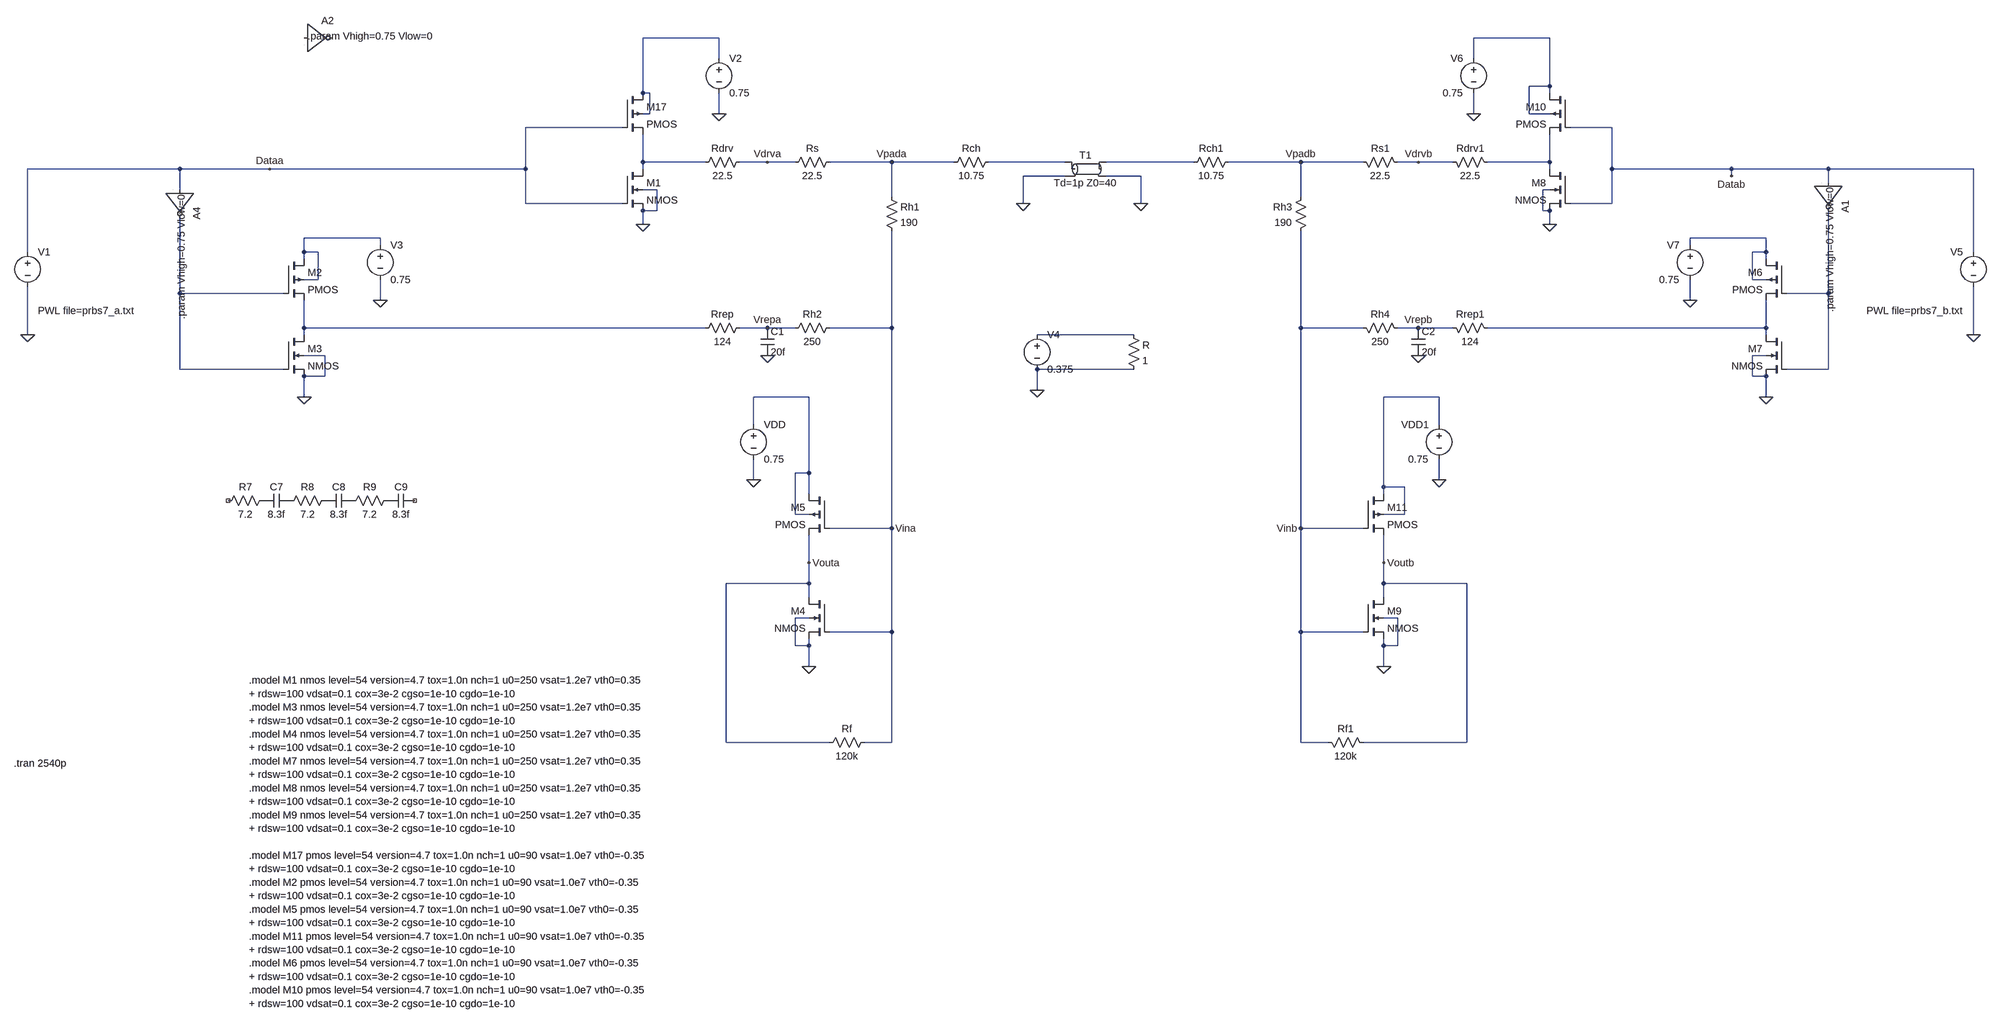
[diagram p0: schematic nvidia.asc]
nvidia.asc, the LTspice schematic file:
Version 4
SHEET 1 3748 1968
WIRE 144 -208 -32 -208
WIRE 2288 -208 2112 -208
WIRE 144 -160 144 -208
WIRE 2112 -160 2112 -208
WIRE 2288 -96 2288 -208
WIRE 2288 -96 2240 -96
WIRE -32 -80 -32 -208
WIRE -16 -80 -32 -80
WIRE 2288 -80 2288 -96
WIRE -16 -32 -16 -80
WIRE -16 -32 -32 -32
WIRE 144 -32 144 -80
WIRE 2112 -32 2112 -80
WIRE 2240 -32 2240 -96
WIRE 2288 -32 2240 -32
WIRE -80 0 -304 0
WIRE 2432 0 2336 0
WIRE -32 80 -32 16
WIRE 112 80 -32 80
WIRE 256 80 192 80
WIRE 320 80 256 80
WIRE 544 80 400 80
WIRE 688 80 544 80
WIRE 944 80 768 80
WIRE 1328 80 1040 80
WIRE 1712 80 1408 80
WIRE 1856 80 1712 80
WIRE 1984 80 1936 80
WIRE 2064 80 1984 80
WIRE 2288 80 2288 16
WIRE 2288 80 2144 80
WIRE -1104 96 -1456 96
WIRE -896 96 -1104 96
WIRE -304 96 -304 0
WIRE -304 96 -896 96
WIRE -32 96 -32 80
WIRE 2288 96 2288 80
WIRE 2432 96 2432 0
WIRE 3152 96 2432 96
WIRE 3376 96 3152 96
WIRE 3712 96 3376 96
WIRE 944 112 848 112
WIRE 1120 112 1040 112
WIRE 3152 112 3152 96
WIRE 3376 128 3376 96
WIRE -1104 144 -1104 96
WIRE 0 144 -32 144
WIRE 2288 144 2272 144
WIRE 544 160 544 80
WIRE 1712 160 1712 80
WIRE -304 176 -304 96
WIRE -80 176 -304 176
WIRE 848 176 848 112
WIRE 1120 176 1120 112
WIRE 2432 176 2432 96
WIRE 2432 176 2336 176
WIRE 0 192 0 144
WIRE 0 192 -32 192
WIRE 2272 192 2272 144
WIRE 2288 192 2272 192
WIRE -32 224 -32 192
WIRE 2288 224 2288 192
WIRE -640 256 -816 256
WIRE 3232 256 3056 256
WIRE -640 272 -640 256
WIRE 3056 272 3056 256
WIRE -1456 288 -1456 96
WIRE -816 288 -816 256
WIRE -784 288 -816 288
WIRE 3232 288 3232 256
WIRE 3232 288 3200 288
WIRE 3712 288 3712 96
WIRE -816 304 -816 288
WIRE 3232 304 3232 288
WIRE -784 352 -784 288
WIRE -784 352 -816 352
WIRE 3200 352 3200 288
WIRE 3232 352 3200 352
WIRE -1104 384 -1104 208
WIRE -864 384 -1104 384
WIRE 3376 384 3376 192
WIRE 3376 384 3280 384
WIRE -640 400 -640 352
WIRE 3056 400 3056 352
WIRE -816 464 -816 400
WIRE 112 464 -816 464
WIRE 256 464 192 464
WIRE 320 464 256 464
WIRE 544 464 544 240
WIRE 544 464 400 464
WIRE 1712 464 1712 240
WIRE 1856 464 1712 464
WIRE 1984 464 1936 464
WIRE 2064 464 1984 464
WIRE 3232 464 3232 400
WIRE 3232 464 2144 464
WIRE -1456 480 -1456 368
WIRE -816 480 -816 464
WIRE 1104 480 880 480
WIRE 3232 480 3232 464
WIRE 3712 480 3712 368
WIRE -768 528 -816 528
WIRE 3232 528 3200 528
WIRE -1104 560 -1104 384
WIRE -864 560 -1104 560
WIRE 1104 560 880 560
WIRE 3376 560 3376 384
WIRE 3376 560 3280 560
WIRE -768 576 -768 528
WIRE -768 576 -816 576
WIRE 3200 576 3200 528
WIRE 3232 576 3200 576
WIRE 880 608 880 560
WIRE -816 624 -816 576
WIRE 352 624 224 624
WIRE 2032 624 1904 624
WIRE 3232 624 3232 576
WIRE 224 688 224 624
WIRE 2032 688 2032 624
WIRE 352 800 352 624
WIRE 352 800 320 800
WIRE 224 816 224 768
WIRE 2032 816 2032 768
WIRE 1904 832 1904 624
WIRE 1952 832 1904 832
WIRE 352 848 352 800
WIRE 1904 848 1904 832
WIRE 320 896 320 800
WIRE 352 896 320 896
WIRE 1952 896 1952 832
WIRE 1952 896 1904 896
WIRE 544 928 544 464
WIRE 544 928 400 928
WIRE 1712 928 1712 464
WIRE 1856 928 1712 928
WIRE 352 1008 352 944
WIRE 1904 1008 1904 944
WIRE 352 1056 352 1008
WIRE 352 1056 160 1056
WIRE 1904 1056 1904 1008
WIRE 2096 1056 1904 1056
WIRE 352 1088 352 1056
WIRE 1904 1088 1904 1056
WIRE 352 1136 320 1136
WIRE 1936 1136 1904 1136
WIRE 544 1168 544 928
WIRE 544 1168 400 1168
WIRE 1712 1168 1712 928
WIRE 1856 1168 1712 1168
WIRE 320 1200 320 1136
WIRE 352 1200 352 1184
WIRE 352 1200 320 1200
WIRE 1904 1200 1904 1184
WIRE 1936 1200 1936 1136
WIRE 1936 1200 1904 1200
WIRE 352 1248 352 1200
WIRE 1904 1248 1904 1200
WIRE 160 1424 160 1056
WIRE 400 1424 160 1424
WIRE 544 1424 544 1168
WIRE 544 1424 480 1424
WIRE 1712 1424 1712 1168
WIRE 1776 1424 1712 1424
WIRE 2096 1424 2096 1056
WIRE 2096 1424 1856 1424
FLAG 848 176 0
FLAG 1120 176 0
FLAG 224 816 0
FLAG 352 1248 0
FLAG 352 1008 Vouta
FLAG 544 928 Vina
FLAG 144 -32 0
FLAG -640 400 0
FLAG -32 224 0
FLAG -816 624 0
FLAG -1456 480 0
FLAG 2032 816 0
FLAG 1904 1248 0
FLAG 1904 1008 Voutb
FLAG 1712 928 Vinb
FLAG 2112 -32 0
FLAG 3056 400 0
FLAG 2288 224 0
FLAG 3232 624 0
FLAG 3712 480 0
FLAG 544 80 Vpada
FLAG 256 80 Vdrva
FLAG 256 464 Vrepa
FLAG -896 96 Dataa
FLAG 1984 80 Vdrvb
FLAG 1984 464 Vrepb
FLAG 3152 112 Datab
FLAG 1712 80 Vpadb
FLAG 256 528 0
FLAG 1984 528 0
FLAG 880 608 0
SYMBOL voltage -1456 272 R0
WINDOW 3 24 152 Left 2
WINDOW 123 0 0 Left 0
WINDOW 39 24 124 Left 2
SYMATTR Value PWL file=prbs7_a.txt
SYMATTR InstName V1
SYMBOL res 416 64 R90
WINDOW 0 0 56 VBottom 2
WINDOW 3 32 56 VTop 2
SYMATTR InstName Rs
SYMATTR Value 22.5
SYMBOL res 528 144 R0
SYMATTR InstName Rh1
SYMATTR Value 190
SYMBOL res 416 448 R90
WINDOW 0 0 56 VBottom 2
WINDOW 3 32 56 VTop 2
SYMATTR InstName Rh2
SYMATTR Value 250
SYMBOL res 784 64 R90
WINDOW 0 0 56 VBottom 2
WINDOW 3 32 56 VTop 2
SYMATTR InstName Rch
SYMATTR Value 10.75
SYMBOL tline 992 96 R0
SYMATTR InstName T1
SYMATTR Value Td=1p Z0=40
SYMBOL voltage 224 672 R0
WINDOW 123 0 0 Left 0
WINDOW 39 0 0 Left 0
SYMATTR InstName VDD
SYMATTR Value 0.75
SYMBOL res 496 1408 R90
WINDOW 0 0 56 VBottom 2
WINDOW 3 32 56 VTop 2
SYMATTR InstName Rf
SYMATTR Value 120k
SYMBOL voltage 144 -176 R0
WINDOW 123 0 0 Left 0
WINDOW 39 0 0 Left 0
SYMATTR InstName V2
SYMATTR Value 0.75
SYMBOL voltage -640 256 R0
WINDOW 123 0 0 Left 0
WINDOW 39 0 0 Left 0
SYMATTR InstName V3
SYMATTR Value 0.75
SYMBOL res 208 64 R90
WINDOW 0 0 56 VBottom 2
WINDOW 3 32 56 VTop 2
SYMATTR InstName Rdrv
SYMATTR Value 22.5
SYMBOL res 208 448 R90
WINDOW 0 0 56 VBottom 2
WINDOW 3 32 56 VTop 2
SYMATTR InstName Rrep
SYMATTR Value 124
SYMBOL voltage 3712 272 M0
WINDOW 3 24 152 Left 2
WINDOW 123 0 0 Left 0
WINDOW 39 24 124 Left 2
SYMATTR Value PWL file=prbs7_b.txt
SYMATTR InstName V5
SYMBOL res 1840 64 M90
WINDOW 0 0 56 VBottom 2
WINDOW 3 32 56 VTop 2
SYMATTR InstName Rs1
SYMATTR Value 22.5
SYMBOL res 1728 144 M0
SYMATTR InstName Rh3
SYMATTR Value 190
SYMBOL res 1840 448 M90
WINDOW 0 0 56 VBottom 2
WINDOW 3 32 56 VTop 2
SYMATTR InstName Rh4
SYMATTR Value 250
SYMBOL voltage 2032 672 M0
WINDOW 123 0 0 Left 0
WINDOW 39 0 0 Left 0
SYMATTR InstName VDD1
SYMATTR Value 0.75
SYMBOL res 1760 1408 M90
WINDOW 0 0 56 VBottom 2
WINDOW 3 32 56 VTop 2
SYMATTR InstName Rf1
SYMATTR Value 120k
SYMBOL voltage 2112 -176 M0
WINDOW 123 0 0 Left 0
WINDOW 39 0 0 Left 0
SYMATTR InstName V6
SYMATTR Value 0.75
SYMBOL voltage 3056 256 M0
WINDOW 123 0 0 Left 0
WINDOW 39 0 0 Left 0
SYMATTR InstName V7
SYMATTR Value 0.75
SYMBOL res 2048 64 M90
WINDOW 0 0 56 VBottom 2
WINDOW 3 32 56 VTop 2
SYMATTR InstName Rdrv1
SYMATTR Value 22.5
SYMBOL res 2048 448 M90
WINDOW 0 0 56 VBottom 2
WINDOW 3 32 56 VTop 2
SYMATTR InstName Rrep1
SYMATTR Value 124
SYMBOL Digital\\inv -816 -272 R0
WINDOW 3 8 60 Left 2
SYMATTR Value .param Vhigh=0.75 Vlow=0
SYMATTR InstName A2
SYMBOL pmos4 -80 -80 R0
SYMATTR InstName M17
SYMATTR Value2 l=45n w=1.0u
SYMBOL nmos4 -80 96 R0
SYMATTR InstName M1
SYMATTR Value2 l=45n w=1.0u
SYMBOL res 1424 64 R90
WINDOW 0 0 56 VBottom 2
WINDOW 3 32 56 VTop 2
SYMATTR InstName Rch1
SYMATTR Value 10.75
SYMBOL pmos4 -864 304 R0
SYMATTR InstName M2
SYMATTR Value2 l=45n w=1.0u
SYMBOL pmos4 400 848 M0
SYMATTR InstName M5
SYMATTR Value2 l=45n w=1.0u
SYMBOL pmos4 3280 304 M0
SYMATTR InstName M6
SYMATTR Value2 l=45n w=1.0u
SYMBOL pmos4 2336 -80 M0
SYMATTR InstName M10
SYMATTR Value2 l=45n w=1.0u
SYMBOL pmos4 1856 848 R0
SYMATTR InstName M11
SYMATTR Value2 l=45n w=1.0u
SYMBOL nmos4 -864 480 R0
SYMATTR InstName M3
SYMATTR Value2 l=45n w=1.0u
SYMBOL nmos4 400 1088 M0
SYMATTR InstName M4
SYMATTR Value2 l=45n w=1.0u
SYMBOL nmos4 3280 480 M0
SYMATTR InstName M7
SYMATTR Value2 l=45n w=1.0u
SYMBOL nmos4 2336 96 M0
SYMATTR InstName M8
SYMATTR Value2 l=45n w=1.0u
SYMBOL nmos4 1856 1088 R0
SYMATTR InstName M9
SYMATTR Value2 l=45n w=1.0u
SYMBOL Digital\\inv -1040 144 R90
WINDOW 3 8 60 Left 2
SYMATTR Value .param Vhigh=0.75 Vlow=0
SYMATTR InstName A4
SYMBOL Digital\\inv 3440 128 R90
WINDOW 3 8 60 Left 2
SYMATTR Value .param Vhigh=0.75 Vlow=0
SYMATTR InstName A1
SYMBOL res -896 848 R90
WINDOW 0 0 56 VBottom 2
WINDOW 3 32 56 VTop 2
SYMATTR InstName R7
SYMATTR Value 7.2
SYMBOL cap -848 848 R90
WINDOW 0 0 32 VBottom 2
WINDOW 3 32 32 VTop 2
SYMATTR InstName C7
SYMATTR Value 8.3f
SYMBOL res -752 848 R90
WINDOW 0 0 56 VBottom 2
WINDOW 3 32 56 VTop 2
SYMATTR InstName R8
SYMATTR Value 7.2
SYMBOL cap -704 848 R90
WINDOW 0 0 32 VBottom 2
WINDOW 3 32 32 VTop 2
SYMATTR InstName C8
SYMATTR Value 8.3f
SYMBOL res -608 848 R90
WINDOW 0 0 56 VBottom 2
WINDOW 3 32 56 VTop 2
SYMATTR InstName R9
SYMATTR Value 7.2
SYMBOL cap -560 848 R90
WINDOW 0 0 32 VBottom 2
WINDOW 3 32 32 VTop 2
SYMATTR InstName C9
SYMATTR Value 8.3f
SYMBOL cap 240 464 R0
SYMATTR InstName C1
SYMATTR Value 20f
SYMBOL cap 1968 464 R0
SYMATTR InstName C2
SYMATTR Value 20f
SYMBOL voltage 880 464 R0
WINDOW 123 0 0 Left 0
WINDOW 39 0 0 Left 0
SYMATTR InstName V4
SYMATTR Value 0.375
SYMBOL res 1088 464 R0
SYMATTR InstName R
SYMATTR Value 1
TEXT -1488 1472 Left 2 !.tran 2540p
TEXT -944 1280 Left 2 !.model M1 nmos level=54 version=4.7 tox=1.0n nch=1 u0=250 vsat=1.2e7 vth0=0.35\n+ rdsw=100 vdsat=0.1 cox=3e-2 cgso=1e-10 cgdo=1e-10\n.model M3 nmos level=54 version=4.7 tox=1.0n nch=1 u0=250 vsat=1.2e7 vth0=0.35\n+ rdsw=100 vdsat=0.1 cox=3e-2 cgso=1e-10 cgdo=1e-10\n.model M4 nmos level=54 version=4.7 tox=1.0n nch=1 u0=250 vsat=1.2e7 vth0=0.35\n+ rdsw=100 vdsat=0.1 cox=3e-2 cgso=1e-10 cgdo=1e-10\n.model M7 nmos level=54 version=4.7 tox=1.0n nch=1 u0=250 vsat=1.2e7 vth0=0.35\n+ rdsw=100 vdsat=0.1 cox=3e-2 cgso=1e-10 cgdo=1e-10\n.model M8 nmos level=54 version=4.7 tox=1.0n nch=1 u0=250 vsat=1.2e7 vth0=0.35\n+ rdsw=100 vdsat=0.1 cox=3e-2 cgso=1e-10 cgdo=1e-10\n.model M9 nmos level=54 version=4.7 tox=1.0n nch=1 u0=250 vsat=1.2e7 vth0=0.35\n+ rdsw=100 vdsat=0.1 cox=3e-2 cgso=1e-10 cgdo=1e-10\n \n.model M17 pmos level=54 version=4.7 tox=1.0n nch=1 u0=90 vsat=1.0e7 vth0=-0.35\n+ rdsw=100 vdsat=0.1 cox=3e-2 cgso=1e-10 cgdo=1e-10\n.model M2 pmos level=54 version=4.7 tox=1.0n nch=1 u0=90 vsat=1.0e7 vth0=-0.35\n+ rdsw=100 vdsat=0.1 cox=3e-2 cgso=1e-10 cgdo=1e-10\n.model M5 pmos level=54 version=4.7 tox=1.0n nch=1 u0=90 vsat=1.0e7 vth0=-0.35\n+ rdsw=100 vdsat=0.1 cox=3e-2 cgso=1e-10 cgdo=1e-10\n.model M11 pmos level=54 version=4.7 tox=1.0n nch=1 u0=90 vsat=1.0e7 vth0=-0.35\n+ rdsw=100 vdsat=0.1 cox=3e-2 cgso=1e-10 cgdo=1e-10\n.model M6 pmos level=54 version=4.7 tox=1.0n nch=1 u0=90 vsat=1.0e7 vth0=-0.35\n+ rdsw=100 vdsat=0.1 cox=3e-2 cgso=1e-10 cgdo=1e-10\n.model M10 pmos level=54 version=4.7 tox=1.0n nch=1 u0=90 vsat=1.0e7 vth0=-0.35\n+ rdsw=100 vdsat=0.1 cox=3e-2 cgso=1e-10 cgdo=1e-10

The netlist it stands for:
* nvidia.asc
V1 Dataa 0 PWL file=prbs7_a.txt
Rs Vpada Vdrva 22.5
Rh1 Vpada Vina 190
Rh2 Vina Vrepa 250
Rch N004 Vpada 10.75
T1 N004 0 N005 0 Td=1p Z0=40
VDD N014 0 0.75
Rf Vina Vouta 120k
V2 N001 0 0.75
V3 N007 0 0.75
Rdrv Vdrva N003 22.5
Rrep Vrepa N011 124
V5 Datab 0 PWL file=prbs7_b.txt
Rs1 Vpadb Vdrvb 22.5
Rh3 Vpadb Vinb 190
Rh4 Vinb Vrepb 250
VDD1 N015 0 0.75
Rf1 Vinb Voutb 120k
V6 N002 0 0.75
V7 N008 0 0.75
Rdrv1 Vdrvb N006 22.5
Rrep1 Vrepb N012 124
A2 0 0 0 0 0 0 0 0 BUF .param Vhigh=0.75 Vlow=0
M17 N001 Dataa N003 N001 PMOS l=45n w=1.0u
M1 N003 Dataa 0 0 NMOS l=45n w=1.0u
Rch1 Vpadb N005 10.75
M2 N007 N009 N011 N007 PMOS l=45n w=1.0u
M5 N014 Vina Vouta N014 PMOS l=45n w=1.0u
M6 N008 N010 N012 N008 PMOS l=45n w=1.0u
M10 N002 Datab N006 N002 PMOS l=45n w=1.0u
M11 N015 Vinb Voutb N015 PMOS l=45n w=1.0u
M3 N011 N009 0 0 NMOS l=45n w=1.0u
M4 Vouta Vina 0 0 NMOS l=45n w=1.0u
M7 N012 N010 0 0 NMOS l=45n w=1.0u
M8 N006 Datab 0 0 NMOS l=45n w=1.0u
M9 Voutb Vinb 0 0 NMOS l=45n w=1.0u
A4 Dataa 0 0 0 0 N009 0 0 BUF .param Vhigh=0.75 Vlow=0
A1 Datab 0 0 0 0 N010 0 0 BUF .param Vhigh=0.75 Vlow=0
R7 P001 NC_01 7.2
C7 P002 P001 8.3f
R8 P003 P002 7.2
C8 P004 P003 8.3f
R9 P005 P004 7.2
C9 NC_02 P005 8.3f
C1 Vrepa 0 20f
C2 Vrepb 0 20f
V4 N013 0 0.375
R N013 0 1
.model NMOS NMOS
.model PMOS PMOS
.lib standard.mos
.tran 2540p
.model M1 nmos level=54 version=4.7 tox=1.0n nch=1 u0=250 vsat=1.2e7 vth0=0.35
+ rdsw=100 vdsat=0.1 cox=3e-2 cgso=1e-10 cgdo=1e-10
.model M3 nmos level=54 version=4.7 tox=1.0n nch=1 u0=250 vsat=1.2e7 vth0=0.35
+ rdsw=100 vdsat=0.1 cox=3e-2 cgso=1e-10 cgdo=1e-10
.model M4 nmos level=54 version=4.7 tox=1.0n nch=1 u0=250 vsat=1.2e7 vth0=0.35
+ rdsw=100 vdsat=0.1 cox=3e-2 cgso=1e-10 cgdo=1e-10
.model M7 nmos level=54 version=4.7 tox=1.0n nch=1 u0=250 vsat=1.2e7 vth0=0.35
+ rdsw=100 vdsat=0.1 cox=3e-2 cgso=1e-10 cgdo=1e-10
.model M8 nmos level=54 version=4.7 tox=1.0n nch=1 u0=250 vsat=1.2e7 vth0=0.35
+ rdsw=100 vdsat=0.1 cox=3e-2 cgso=1e-10 cgdo=1e-10
.model M9 nmos level=54 version=4.7 tox=1.0n nch=1 u0=250 vsat=1.2e7 vth0=0.35
+ rdsw=100 vdsat=0.1 cox=3e-2 cgso=1e-10 cgdo=1e-10
.model M17 pmos level=54 version=4.7 tox=1.0n nch=1 u0=90 vsat=1.0e7 vth0=-0.35
+ rdsw=100 vdsat=0.1 cox=3e-2 cgso=1e-10 cgdo=1e-10
.model M2 pmos level=54 version=4.7 tox=1.0n nch=1 u0=90 vsat=1.0e7 vth0=-0.35
+ rdsw=100 vdsat=0.1 cox=3e-2 cgso=1e-10 cgdo=1e-10
.model M5 pmos level=54 version=4.7 tox=1.0n nch=1 u0=90 vsat=1.0e7 vth0=-0.35
+ rdsw=100 vdsat=0.1 cox=3e-2 cgso=1e-10 cgdo=1e-10
.model M11 pmos level=54 version=4.7 tox=1.0n nch=1 u0=90 vsat=1.0e7 vth0=-0.35
+ rdsw=100 vdsat=0.1 cox=3e-2 cgso=1e-10 cgdo=1e-10
.model M6 pmos level=54 version=4.7 tox=1.0n nch=1 u0=90 vsat=1.0e7 vth0=-0.35
+ rdsw=100 vdsat=0.1 cox=3e-2 cgso=1e-10 cgdo=1e-10
.model M10 pmos level=54 version=4.7 tox=1.0n nch=1 u0=90 vsat=1.0e7 vth0=-0.35
+ rdsw=100 vdsat=0.1 cox=3e-2 cgso=1e-10 cgdo=1e-10
.backanno
.end